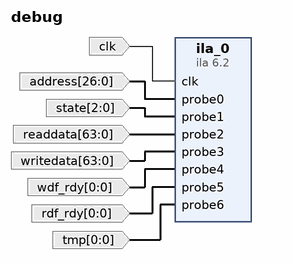
[diagram p0: block diagram of the top level]
# Vivado block design debug, xc7a100tcsg324-1, Vivado 2020.1
create_bd_design debug

create_bd_port -dir I -type clk clk
create_bd_port -dir I -from 26 -to 0 address
create_bd_port -dir I -from 2 -to 0 state
create_bd_port -dir I -from 63 -to 0 readdata
create_bd_port -dir I -from 63 -to 0 writedata
create_bd_port -dir I -from 0 -to 0 wdf_rdy
create_bd_port -dir I -from 0 -to 0 rdf_rdy
create_bd_port -dir I -from 0 -to 0 tmp

create_bd_cell -type ip -vlnv xilinx.com:ip:ila:6.2 ila_0
set_property -dict [list \
  CONFIG.C_DATA_DEPTH 2048 \
  CONFIG.C_ENABLE_ILA_AXI_MON false \
  CONFIG.C_MONITOR_TYPE Native \
  CONFIG.C_NUM_OF_PROBES 7 \
  CONFIG.C_PROBE0_WIDTH 27 \
  CONFIG.C_PROBE1_WIDTH 3 \
  CONFIG.C_PROBE2_WIDTH 64 \
  CONFIG.C_PROBE3_WIDTH 64 \
] [get_bd_cells ila_0]

# ---- connections ----

connect_bd_net -net clk_0_1 [get_bd_ports clk] [get_bd_pins ila_0/clk]
connect_bd_net -net probe0_0_1 [get_bd_ports address] [get_bd_pins ila_0/probe0]
connect_bd_net -net probe1_0_1 [get_bd_ports state] [get_bd_pins ila_0/probe1]
connect_bd_net -net probe2_0_1 [get_bd_ports readdata] [get_bd_pins ila_0/probe2]
connect_bd_net -net probe3_0_1 [get_bd_ports writedata] [get_bd_pins ila_0/probe3]
connect_bd_net -net probe4_0_1 [get_bd_ports wdf_rdy] [get_bd_pins ila_0/probe4]
connect_bd_net -net probe5_0_1 [get_bd_ports rdf_rdy] [get_bd_pins ila_0/probe5]
connect_bd_net -net probe6_0_1 [get_bd_ports tmp] [get_bd_pins ila_0/probe6]

validate_bd_design
save_bd_design
